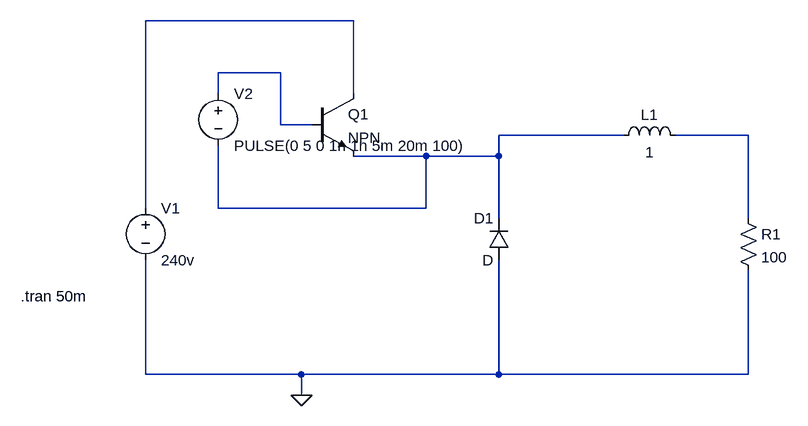
[diagram p0: schematic DCChopper.asc]
DCChopper.asc, the LTspice schematic file:
Version 4
SHEET 1 880 680
WIRE 128 32 -192 32
WIRE 16 112 -80 112
WIRE -80 144 -80 112
WIRE 128 144 128 32
WIRE 16 192 16 112
WIRE 64 192 16 192
WIRE 544 208 352 208
WIRE 736 208 624 208
WIRE 240 240 128 240
WIRE 352 240 352 208
WIRE 352 240 240 240
WIRE -192 320 -192 32
WIRE -80 320 -80 224
WIRE 240 320 240 240
WIRE 240 320 -80 320
WIRE 352 336 352 240
WIRE 736 336 736 208
WIRE -192 576 -192 400
WIRE 48 576 -192 576
WIRE 352 576 352 400
WIRE 352 576 48 576
WIRE 736 576 736 416
WIRE 736 576 352 576
WIRE 48 608 48 576
FLAG 48 608 0
SYMBOL npn 64 144 R0
SYMATTR InstName Q1
SYMBOL diode 368 400 R180
WINDOW 0 24 64 Left 2
WINDOW 3 24 0 Left 2
SYMATTR InstName D1
SYMBOL ind 528 224 R270
WINDOW 0 32 56 VTop 2
WINDOW 3 5 56 VBottom 2
SYMATTR InstName L1
SYMATTR Value 1
SYMBOL res 720 320 R0
SYMATTR InstName R1
SYMATTR Value 100
SYMBOL voltage -192 304 R0
SYMATTR InstName V1
SYMATTR Value 240v
SYMBOL voltage -80 128 R0
SYMATTR InstName V2
SYMATTR Value PULSE(0 5 0 1n 1n 5m 20m 100)
TEXT -384 456 Left 2 !.tran 50m

The netlist it stands for:
* DCChopper.asc
Q1 N001 N002 N003 0 NPN
D1 0 N003 D
L1 N003 N004 1
R1 N004 0 100
V1 N001 0 240v
V2 N002 N003 PULSE(0 5 0 1n 1n 5m 20m 100)
.model D D
.lib standard.dio
.model NPN NPN
.model PNP PNP
.lib standard.bjt
.tran 50m
.backanno
.end